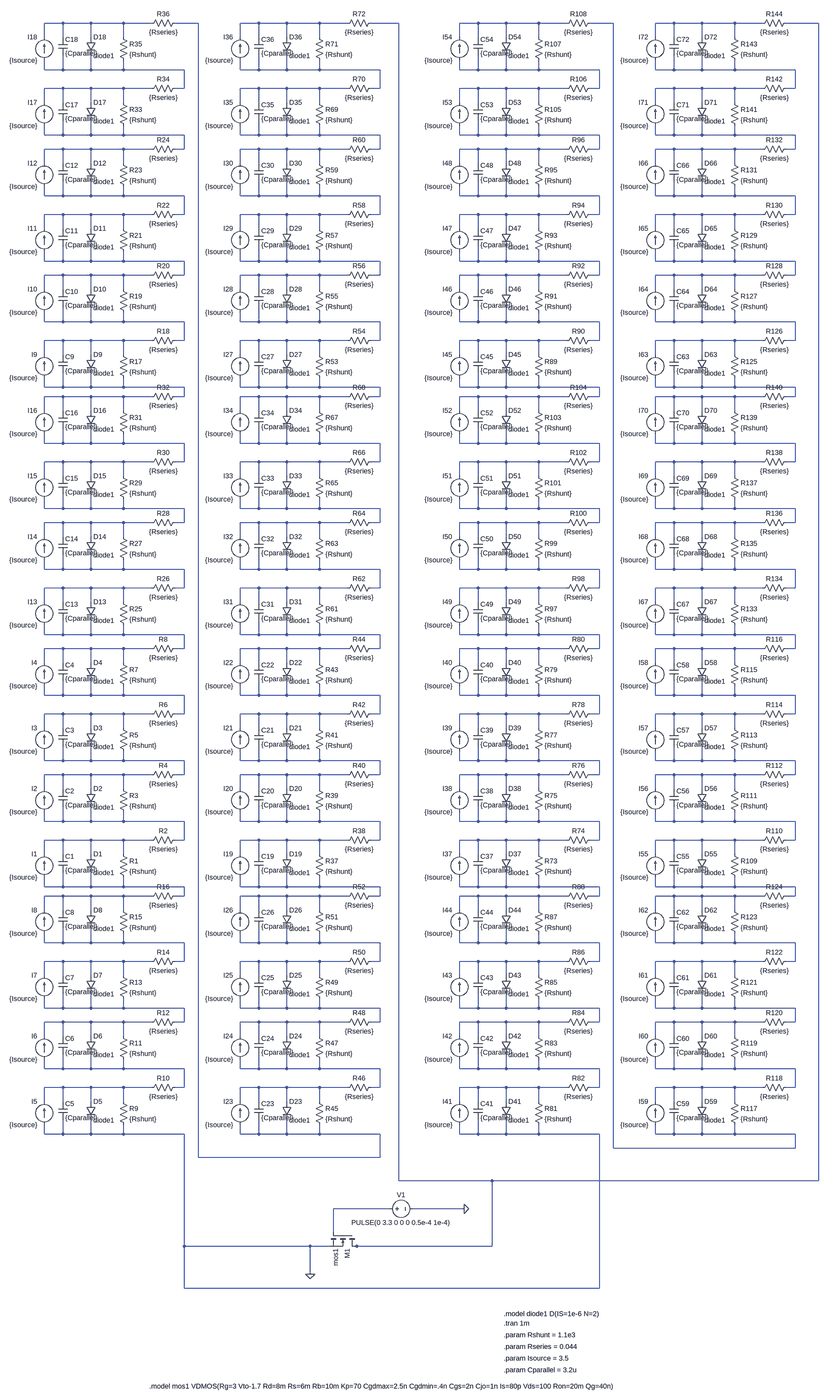
[diagram p0: schematic fetsim2.asc, whole sheet]
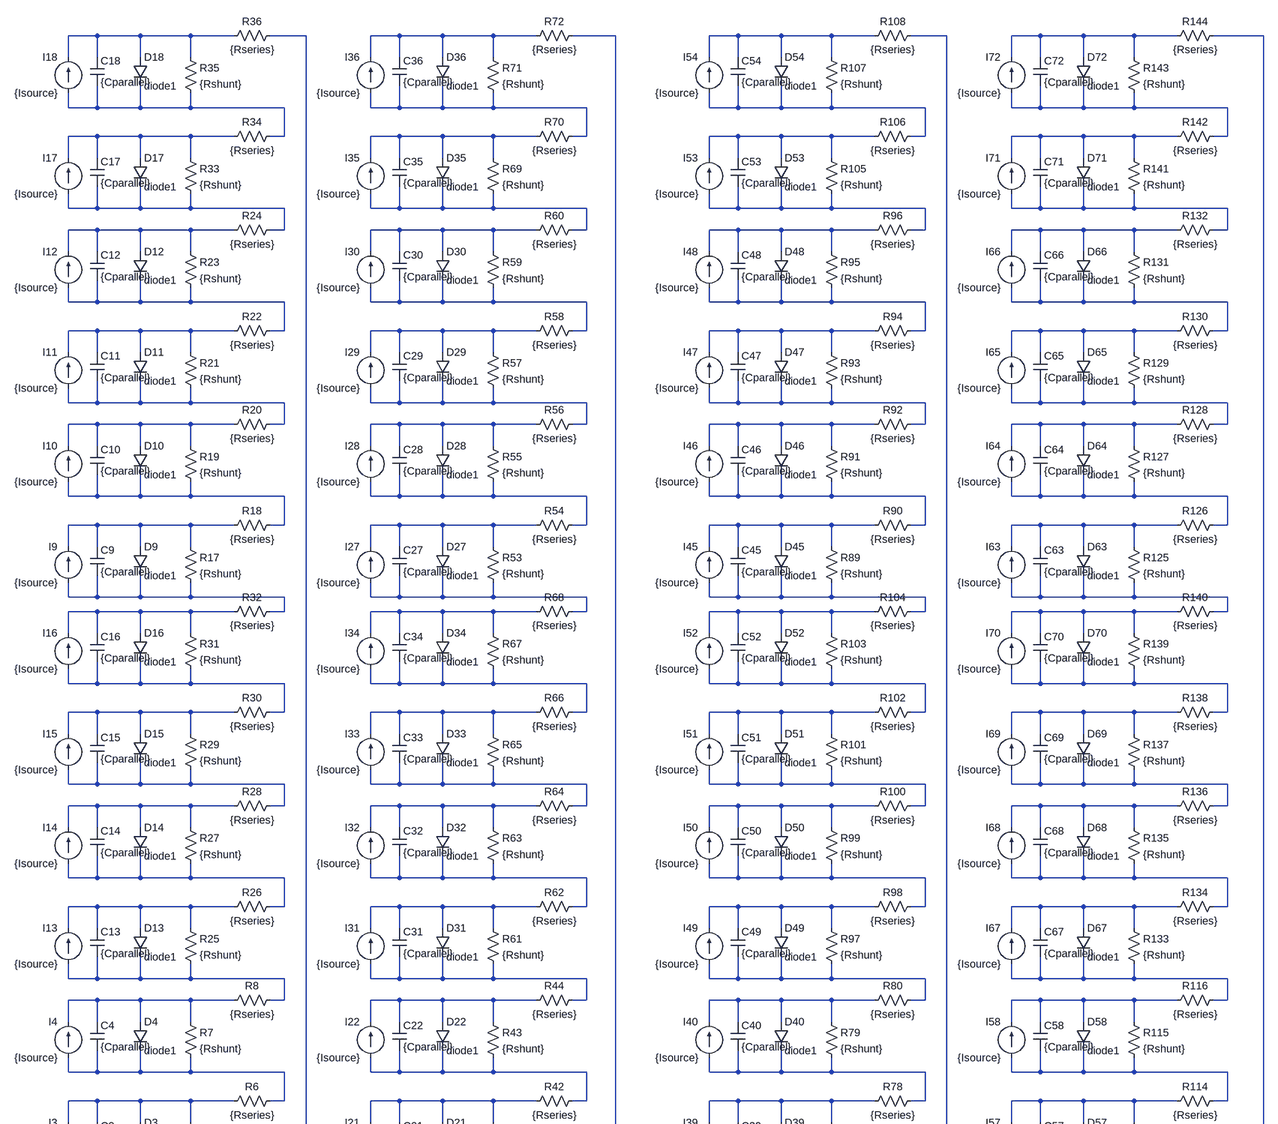
[diagram p1: schematic fetsim2.asc, part, row 1 of 2, column 1 of 1]
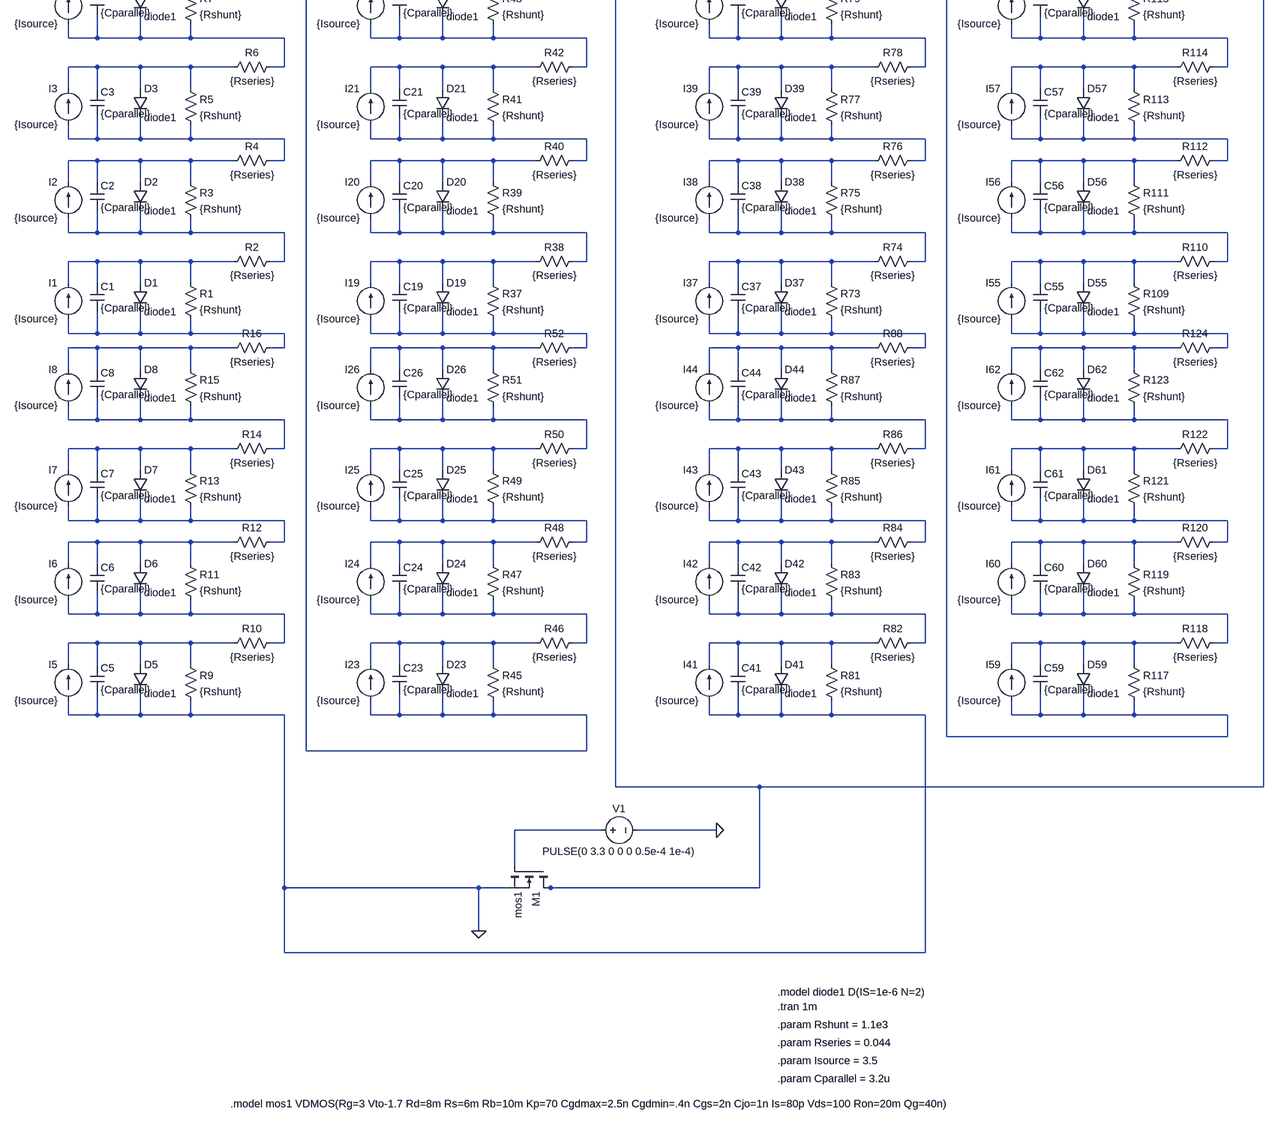
[diagram p2: schematic fetsim2.asc, part, row 2 of 2, column 1 of 1]
* fetsim2.asc
I1 N112 N108 {Isource}
C1 N108 N112 {Cparallel}
D1 N108 N112 diode1
R1 N108 N112 {Rshunt}
R2 N104 N108 {Rseries}
I2 N104 N100 {Isource}
C2 N100 N104 {Cparallel}
D2 N100 N104 diode1
R3 N100 N104 {Rshunt}
R4 N096 N100 {Rseries}
I3 N096 N092 {Isource}
C3 N092 N096 {Cparallel}
D3 N092 N096 diode1
R5 N092 N096 {Rshunt}
R6 N088 N092 {Rseries}
I4 N088 N084 {Isource}
C4 N084 N088 {Cparallel}
D4 N084 N088 diode1
R7 N084 N088 {Rshunt}
R8 N080 N084 {Rseries}
I5 0 N140 {Isource}
C5 N140 0 {Cparallel}
D5 N140 0 diode1
R9 N140 0 {Rshunt}
R10 N136 N140 {Rseries}
I6 N136 N132 {Isource}
C6 N132 N136 {Cparallel}
D6 N132 N136 diode1
R11 N132 N136 {Rshunt}
R12 N128 N132 {Rseries}
I7 N128 N124 {Isource}
C7 N124 N128 {Cparallel}
D7 N124 N128 diode1
R13 N124 N128 {Rshunt}
R14 N120 N124 {Rseries}
I8 N120 N116 {Isource}
C8 N116 N120 {Cparallel}
D8 N116 N120 diode1
R15 N116 N120 {Rshunt}
R16 N112 N116 {Rseries}
I9 N048 N044 {Isource}
C9 N044 N048 {Cparallel}
D9 N044 N048 diode1
R17 N044 N048 {Rshunt}
R18 N040 N044 {Rseries}
I10 N040 N036 {Isource}
C10 N036 N040 {Cparallel}
D10 N036 N040 diode1
R19 N036 N040 {Rshunt}
R20 N032 N036 {Rseries}
I11 N032 N028 {Isource}
C11 N028 N032 {Cparallel}
D11 N028 N032 diode1
R21 N028 N032 {Rshunt}
R22 N024 N028 {Rseries}
I12 N024 N020 {Isource}
C12 N020 N024 {Cparallel}
D12 N020 N024 diode1
R23 N020 N024 {Rshunt}
R24 N016 N020 {Rseries}
I13 N080 N076 {Isource}
C13 N076 N080 {Cparallel}
D13 N076 N080 diode1
R25 N076 N080 {Rshunt}
R26 N072 N076 {Rseries}
I14 N072 N068 {Isource}
C14 N068 N072 {Cparallel}
D14 N068 N072 diode1
R27 N068 N072 {Rshunt}
R28 N064 N068 {Rseries}
I15 N064 N060 {Isource}
C15 N060 N064 {Cparallel}
D15 N060 N064 diode1
R29 N060 N064 {Rshunt}
R30 N056 N060 {Rseries}
I16 N056 N052 {Isource}
C16 N052 N056 {Cparallel}
D16 N052 N056 diode1
R31 N052 N056 {Rshunt}
R32 N048 N052 {Rseries}
I17 N016 N012 {Isource}
C17 N012 N016 {Cparallel}
D17 N012 N016 diode1
R33 N012 N016 {Rshunt}
R34 N008 N012 {Rseries}
I18 N008 N001 {Isource}
C18 N001 N008 {Cparallel}
D18 N001 N008 diode1
R35 N001 N008 {Rshunt}
R36 N002 N001 {Rseries}
I19 N113 N109 {Isource}
C19 N109 N113 {Cparallel}
D19 N109 N113 diode1
R37 N109 N113 {Rshunt}
R38 N105 N109 {Rseries}
I20 N105 N101 {Isource}
C20 N101 N105 {Cparallel}
D20 N101 N105 diode1
R39 N101 N105 {Rshunt}
R40 N097 N101 {Rseries}
I21 N097 N093 {Isource}
C21 N093 N097 {Cparallel}
D21 N093 N097 diode1
R41 N093 N097 {Rshunt}
R42 N089 N093 {Rseries}
I22 N089 N085 {Isource}
C22 N085 N089 {Cparallel}
D22 N085 N089 diode1
R43 N085 N089 {Rshunt}
R44 N081 N085 {Rseries}
I23 N002 N141 {Isource}
C23 N141 N002 {Cparallel}
D23 N141 N002 diode1
R45 N141 N002 {Rshunt}
R46 N137 N141 {Rseries}
I24 N137 N133 {Isource}
C24 N133 N137 {Cparallel}
D24 N133 N137 diode1
R47 N133 N137 {Rshunt}
R48 N129 N133 {Rseries}
I25 N129 N125 {Isource}
C25 N125 N129 {Cparallel}
D25 N125 N129 diode1
R49 N125 N129 {Rshunt}
R50 N121 N125 {Rseries}
I26 N121 N117 {Isource}
C26 N117 N121 {Cparallel}
D26 N117 N121 diode1
R51 N117 N121 {Rshunt}
R52 N113 N117 {Rseries}
I27 N049 N045 {Isource}
C27 N045 N049 {Cparallel}
D27 N045 N049 diode1
R53 N045 N049 {Rshunt}
R54 N041 N045 {Rseries}
I28 N041 N037 {Isource}
C28 N037 N041 {Cparallel}
D28 N037 N041 diode1
R55 N037 N041 {Rshunt}
R56 N033 N037 {Rseries}
I29 N033 N029 {Isource}
C29 N029 N033 {Cparallel}
D29 N029 N033 diode1
R57 N029 N033 {Rshunt}
R58 N025 N029 {Rseries}
I30 N025 N021 {Isource}
C30 N021 N025 {Cparallel}
D30 N021 N025 diode1
R59 N021 N025 {Rshunt}
R60 N017 N021 {Rseries}
I31 N081 N077 {Isource}
C31 N077 N081 {Cparallel}
D31 N077 N081 diode1
R61 N077 N081 {Rshunt}
R62 N073 N077 {Rseries}
I32 N073 N069 {Isource}
C32 N069 N073 {Cparallel}
D32 N069 N073 diode1
R63 N069 N073 {Rshunt}
R64 N065 N069 {Rseries}
I33 N065 N061 {Isource}
C33 N061 N065 {Cparallel}
D33 N061 N065 diode1
R65 N061 N065 {Rshunt}
R66 N057 N061 {Rseries}
I34 N057 N053 {Isource}
C34 N053 N057 {Cparallel}
D34 N053 N057 diode1
R67 N053 N057 {Rshunt}
R68 N049 N053 {Rseries}
I35 N017 N013 {Isource}
C35 N013 N017 {Cparallel}
D35 N013 N017 diode1
R69 N013 N017 {Rshunt}
R70 N009 N013 {Rseries}
I36 N009 N003 {Isource}
C36 N003 N009 {Cparallel}
D36 N003 N009 diode1
R71 N003 N009 {Rshunt}
R72 N004 N003 {Rseries}
I37 N114 N110 {Isource}
C37 N110 N114 {Cparallel}
D37 N110 N114 diode1
R73 N110 N114 {Rshunt}
R74 N106 N110 {Rseries}
I38 N106 N102 {Isource}
C38 N102 N106 {Cparallel}
D38 N102 N106 diode1
R75 N102 N106 {Rshunt}
R76 N098 N102 {Rseries}
I39 N098 N094 {Isource}
C39 N094 N098 {Cparallel}
D39 N094 N098 diode1
R77 N094 N098 {Rshunt}
R78 N090 N094 {Rseries}
I40 N090 N086 {Isource}
C40 N086 N090 {Cparallel}
D40 N086 N090 diode1
R79 N086 N090 {Rshunt}
R80 N082 N086 {Rseries}
I41 0 N142 {Isource}
C41 N142 0 {Cparallel}
D41 N142 0 diode1
R81 N142 0 {Rshunt}
R82 N138 N142 {Rseries}
I42 N138 N134 {Isource}
C42 N134 N138 {Cparallel}
D42 N134 N138 diode1
R83 N134 N138 {Rshunt}
R84 N130 N134 {Rseries}
I43 N130 N126 {Isource}
C43 N126 N130 {Cparallel}
D43 N126 N130 diode1
R85 N126 N130 {Rshunt}
R86 N122 N126 {Rseries}
I44 N122 N118 {Isource}
C44 N118 N122 {Cparallel}
D44 N118 N122 diode1
R87 N118 N122 {Rshunt}
R88 N114 N118 {Rseries}
I45 N050 N046 {Isource}
C45 N046 N050 {Cparallel}
D45 N046 N050 diode1
R89 N046 N050 {Rshunt}
R90 N042 N046 {Rseries}
I46 N042 N038 {Isource}
C46 N038 N042 {Cparallel}
D46 N038 N042 diode1
R91 N038 N042 {Rshunt}
R92 N034 N038 {Rseries}
I47 N034 N030 {Isource}
C47 N030 N034 {Cparallel}
D47 N030 N034 diode1
R93 N030 N034 {Rshunt}
R94 N026 N030 {Rseries}
I48 N026 N022 {Isource}
C48 N022 N026 {Cparallel}
D48 N022 N026 diode1
R95 N022 N026 {Rshunt}
R96 N018 N022 {Rseries}
I49 N082 N078 {Isource}
C49 N078 N082 {Cparallel}
D49 N078 N082 diode1
R97 N078 N082 {Rshunt}
R98 N074 N078 {Rseries}
I50 N074 N070 {Isource}
C50 N070 N074 {Cparallel}
D50 N070 N074 diode1
R99 N070 N074 {Rshunt}
R100 N066 N070 {Rseries}
I51 N066 N062 {Isource}
C51 N062 N066 {Cparallel}
D51 N062 N066 diode1
R101 N062 N066 {Rshunt}
R102 N058 N062 {Rseries}
I52 N058 N054 {Isource}
C52 N054 N058 {Cparallel}
D52 N054 N058 diode1
R103 N054 N058 {Rshunt}
R104 N050 N054 {Rseries}
I53 N018 N014 {Isource}
C53 N014 N018 {Cparallel}
D53 N014 N018 diode1
R105 N014 N018 {Rshunt}
R106 N010 N014 {Rseries}
I54 N010 N005 {Isource}
C54 N005 N010 {Cparallel}
D54 N005 N010 diode1
R107 N005 N010 {Rshunt}
R108 N006 N005 {Rseries}
I55 N115 N111 {Isource}
C55 N111 N115 {Cparallel}
D55 N111 N115 diode1
R109 N111 N115 {Rshunt}
R110 N107 N111 {Rseries}
I56 N107 N103 {Isource}
C56 N103 N107 {Cparallel}
D56 N103 N107 diode1
R111 N103 N107 {Rshunt}
R112 N099 N103 {Rseries}
I57 N099 N095 {Isource}
C57 N095 N099 {Cparallel}
D57 N095 N099 diode1
R113 N095 N099 {Rshunt}
R114 N091 N095 {Rseries}
I58 N091 N087 {Isource}
C58 N087 N091 {Cparallel}
D58 N087 N091 diode1
R115 N087 N091 {Rshunt}
R116 N083 N087 {Rseries}
I59 N006 N143 {Isource}
C59 N143 N006 {Cparallel}
D59 N143 N006 diode1
R117 N143 N006 {Rshunt}
R118 N139 N143 {Rseries}
I60 N139 N135 {Isource}
C60 N135 N139 {Cparallel}
D60 N135 N139 diode1
R119 N135 N139 {Rshunt}
R120 N131 N135 {Rseries}
I61 N131 N127 {Isource}
C61 N127 N131 {Cparallel}
D61 N127 N131 diode1
R121 N127 N131 {Rshunt}
R122 N123 N127 {Rseries}
I62 N123 N119 {Isource}
C62 N119 N123 {Cparallel}
D62 N119 N123 diode1
R123 N119 N123 {Rshunt}
R124 N115 N119 {Rseries}
I63 N051 N047 {Isource}
C63 N047 N051 {Cparallel}
D63 N047 N051 diode1
R125 N047 N051 {Rshunt}
R126 N043 N047 {Rseries}
I64 N043 N039 {Isource}
C64 N039 N043 {Cparallel}
D64 N039 N043 diode1
R127 N039 N043 {Rshunt}
R128 N035 N039 {Rseries}
I65 N035 N031 {Isource}
C65 N031 N035 {Cparallel}
D65 N031 N035 diode1
R129 N031 N035 {Rshunt}
R130 N027 N031 {Rseries}
I66 N027 N023 {Isource}
C66 N023 N027 {Cparallel}
D66 N023 N027 diode1
R131 N023 N027 {Rshunt}
R132 N019 N023 {Rseries}
I67 N083 N079 {Isource}
C67 N079 N083 {Cparallel}
D67 N079 N083 diode1
R133 N079 N083 {Rshunt}
R134 N075 N079 {Rseries}
I68 N075 N071 {Isource}
C68 N071 N075 {Cparallel}
D68 N071 N075 diode1
R135 N071 N075 {Rshunt}
R136 N067 N071 {Rseries}
I69 N067 N063 {Isource}
C69 N063 N067 {Cparallel}
D69 N063 N067 diode1
R137 N063 N067 {Rshunt}
R138 N059 N063 {Rseries}
I70 N059 N055 {Isource}
C70 N055 N059 {Cparallel}
D70 N055 N059 diode1
R139 N055 N059 {Rshunt}
R140 N051 N055 {Rseries}
I71 N019 N015 {Isource}
C71 N015 N019 {Cparallel}
D71 N015 N019 diode1
R141 N015 N019 {Rshunt}
R142 N011 N015 {Rseries}
I72 N011 N007 {Isource}
C72 N007 N011 {Cparallel}
D72 N007 N011 diode1
R143 N007 N011 {Rshunt}
R144 N004 N007 {Rseries}
M1 N004 N144 0 0 mos1
V1 N144 0 PULSE(0 3.3 0 0 0 0.5e-4 1e-4)
.model D D
.lib standard.dio
.model NMOS NMOS
.model PMOS PMOS
.lib standard.mos
.model diode1 D(IS=1e-6 N=2)
.tran 1m
.param Rshunt = 1.1e3
.param Rseries = 0.044
.param Isource = 3.5
.param Cparallel = 3.2u
.model mos1 VDMOS(Rg=3 Vto-1.7 Rd=8m Rs=6m Rb=10m Kp=70 Cgdmax=2.5n Cgdmin=.4n Cgs=2n Cjo=1n Is=80p Vds=100 Ron=20m Qg=40n)
.backanno
.end